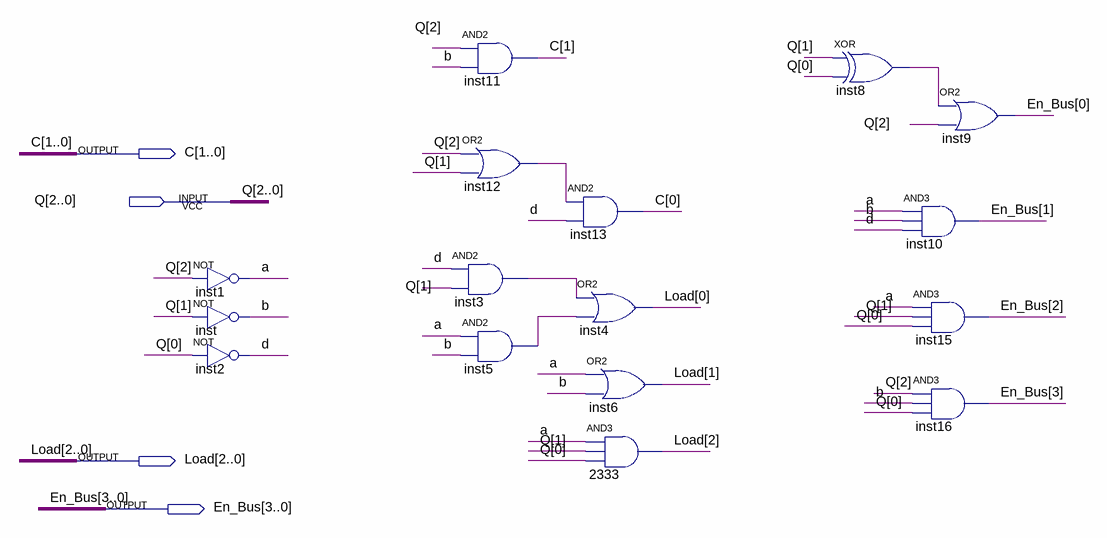
[diagram p0: schematic sheet]
// Quartus schematic Output_Logic_3.bdf as structural Verilog: 16 symbols, 4 pins
module Output_Logic_3 (
  input  [2:0] Q,
  output [1:0] C,
  output [2:0] Load,
  output [3:0] En_Bus
);

  wire a, b, d, inst3_out, inst5_out, inst8_out, inst12_out;

  not inst1 (a, Q[2]);
  not inst (b, Q[1]);
  not inst2 (d, Q[0]);
  and inst11 (C[1], Q[2], b);
  or inst12 (inst12_out, Q[2], Q[1]);
  and inst3 (inst3_out, d, Q[1]);
  and inst5 (inst5_out, a, b);
  and inst13 (C[0], inst12_out, d);
  or inst4 (Load[0], inst3_out, inst5_out);
  or inst6 (Load[1], a, b);
  and u_2333 (Load[2], a, Q[1], Q[0]);
  xor inst8 (inst8_out, Q[1], Q[0]);
  or inst9 (En_Bus[0], inst8_out, Q[2]);
  and inst10 (En_Bus[1], a, b, d);
  and inst15 (En_Bus[2], a, Q[1], Q[0]);
  and inst16 (En_Bus[3], Q[2], b, Q[0]);
endmodule
